# EAGLE design Jaguar (EAGLE 9.6.2)
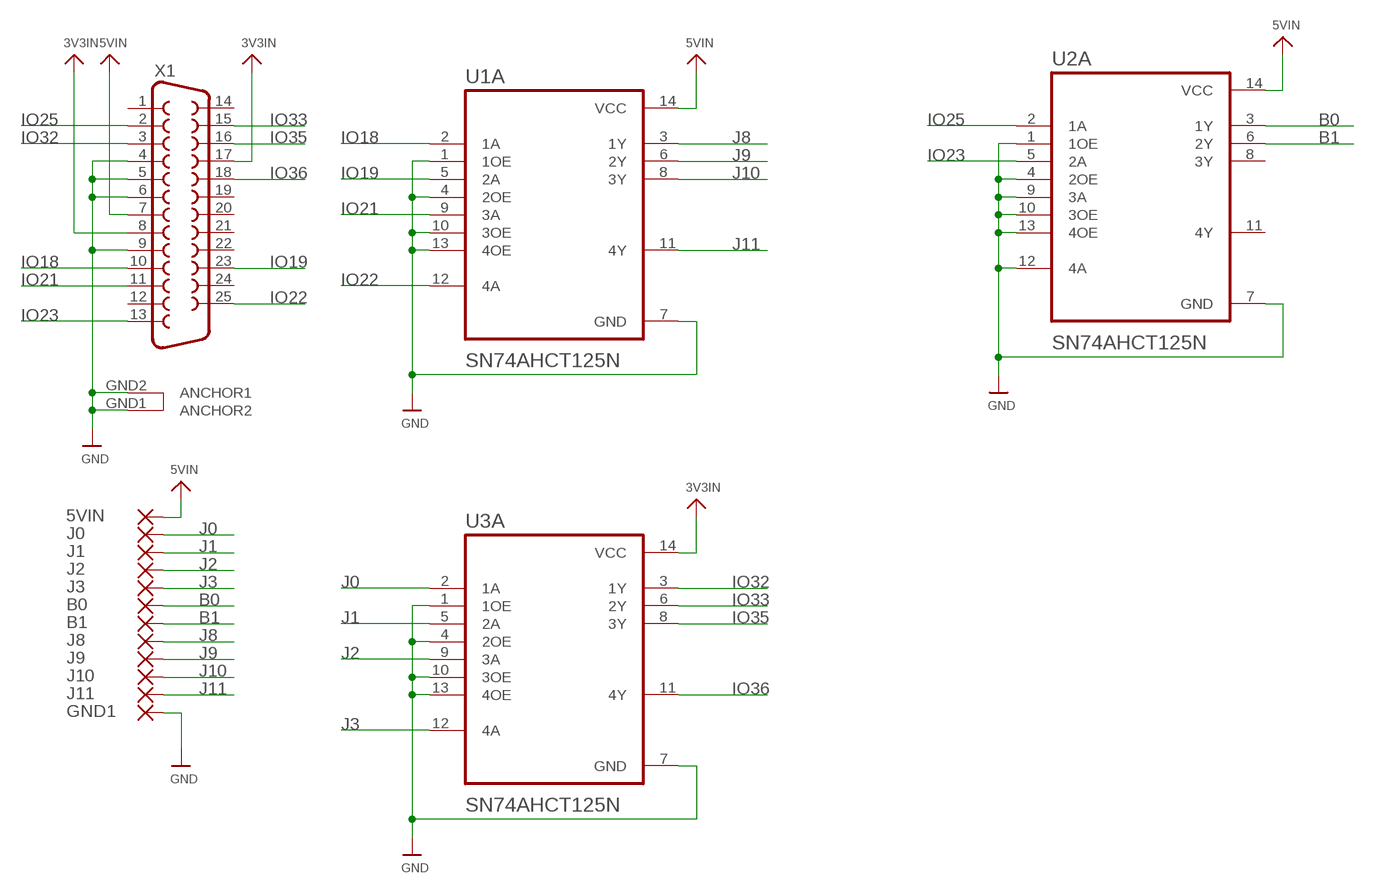
[diagram p0: schematic, sheet 1]

## Parts
5VIN  SMD5  [SMD2,54-5,08]
B0  SMD5  [SMD2,54-5,08]
B1  SMD5  [SMD2,54-5,08]
GND1  SMD5  [SMD2,54-5,08]
J0  SMD5  [SMD2,54-5,08]
J1  SMD5  [SMD2,54-5,08]
J2  SMD5  [SMD2,54-5,08]
J3  SMD5  [SMD2,54-5,08]
J8  SMD5  [SMD2,54-5,08]
J9  SMD5  [SMD2,54-5,08]
J10  SMD5  [SMD2,54-5,08]
J11  SMD5  [SMD2,54-5,08]
U1A  SN74AHCT125N  [DIP794W45P254L1969H508Q14]
U2A  SN74AHCT125N  [DIP794W45P254L1969H508Q14]
U3A  SN74AHCT125N  [DIP794W45P254L1969H508Q14]
X1  DB25_FEMALEHP  [F25HP]

## Nets
3V3IN: U3A.14(VCC) X1.8 X1.17
5VIN: 5VIN.1(P) U1A.14(VCC) U2A.14(VCC) X1.7
B0: B0.1(P) U2A.3(1Y)
B1: B1.1(P) U2A.6(2Y)
GND: GND1.1(P) U1A.1(1OE) U1A.4(2OE) U1A.7(GND) U1A.10(3OE) U1A.13(4OE) U2A.1(1OE) U2A.4(2OE) U2A.7(GND) U2A.9(3A) U2A.10(3OE) U2A.12(4A) U2A.13(4OE) U3A.1(1OE) U3A.4(2OE) U3A.7(GND) U3A.10(3OE) U3A.13(4OE) X1.4 X1.5 X1.6 X1.9 X1.GND1(ANCHOR2) X1.GND2(ANCHOR1)
IO18: U1A.2(1A) X1.10
IO19: U1A.5(2A) X1.23
IO21: U1A.9(3A) X1.11
IO22: U1A.12(4A) X1.25
IO23: U2A.5(2A) X1.13
IO25: U2A.2(1A) X1.2
IO32: U3A.3(1Y) X1.3
IO33: U3A.6(2Y) X1.15
IO35: U3A.8(3Y) X1.16
IO36: U3A.11(4Y) X1.18
J0: J0.1(P) U3A.2(1A)
J1: J1.1(P) U3A.5(2A)
J2: J2.1(P) U3A.9(3A)
J3: J3.1(P) U3A.12(4A)
J8: J8.1(P) U1A.3(1Y)
J9: J9.1(P) U1A.6(2Y)
J10: J10.1(P) U1A.8(3Y)
J11: J11.1(P) U1A.11(4Y)
Unconnected: U2A.8(3Y) U2A.11(4Y) X1.1 X1.12 X1.14 X1.19 X1.20 X1.21 X1.22 X1.24

## Library data of the parts
5VIN B0 B1 GND1 J0 J1-J3 J8-J11 = wirepad:SMD5: SMD PAD
U1A U2A U3A = SN74AHCT125N:SN74AHCT125N: None Check prices <https://pricing.snapeda.com/parts/SN74AHCT125N/Texas%20Instruments/view-part?ref=eda>; AVAILABILITY: In Stock; DESCRIPTION: Quadruple Bus Buffer Gates With 3-State Outputs 14-PDIP -40 to 125; MF: Texas Instruments; MP: SN74AHCT125N; PACKAGE: PDIP-14 Texas Instruments; PRICE: None; PURCHASE-URL: https://pricing.snapeda.com/search/part/SN74AHCT125N/?ref=eda
X1 = SparkFun-Retired:DB25_FEMALE: 25 Pin male connector. PCB edge mount for regular PCB thicknesses. This connector will connect directly to the back of a PC parallel port or through a normal DB25 extension cable (M/F). SKU: PRT-08287

## Board
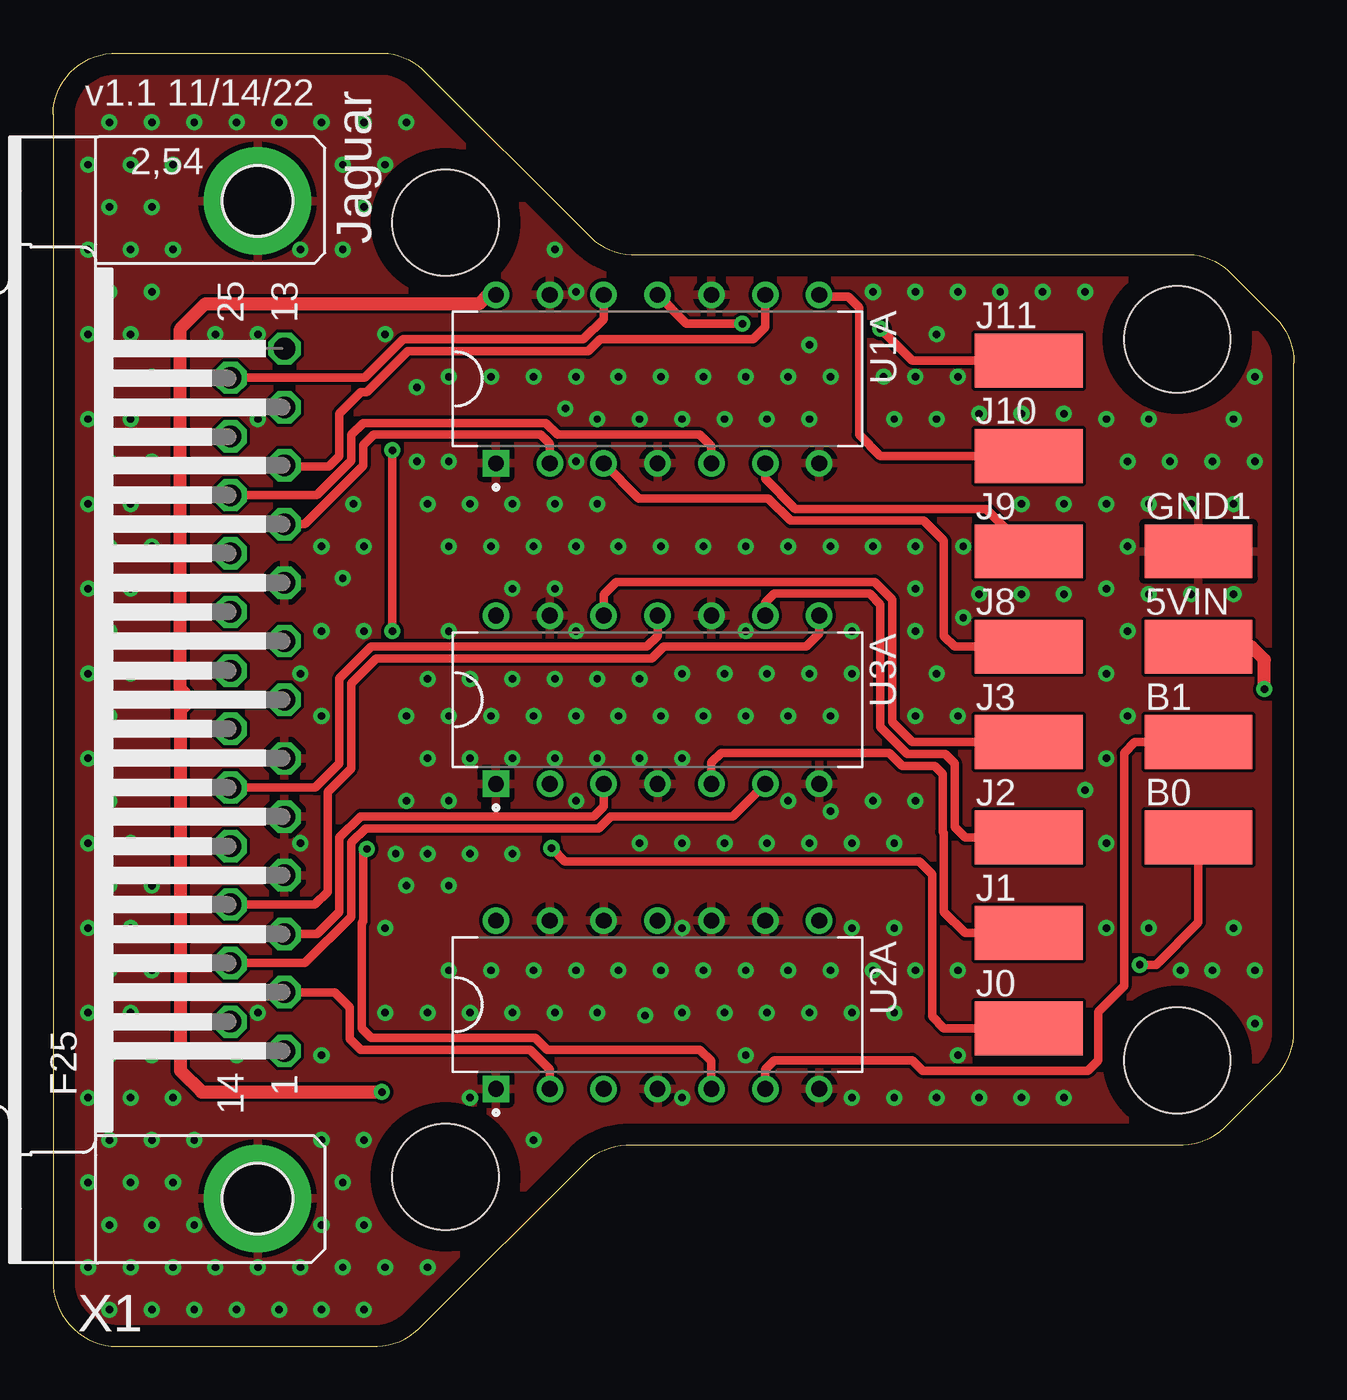
[diagram p1: board, top side]
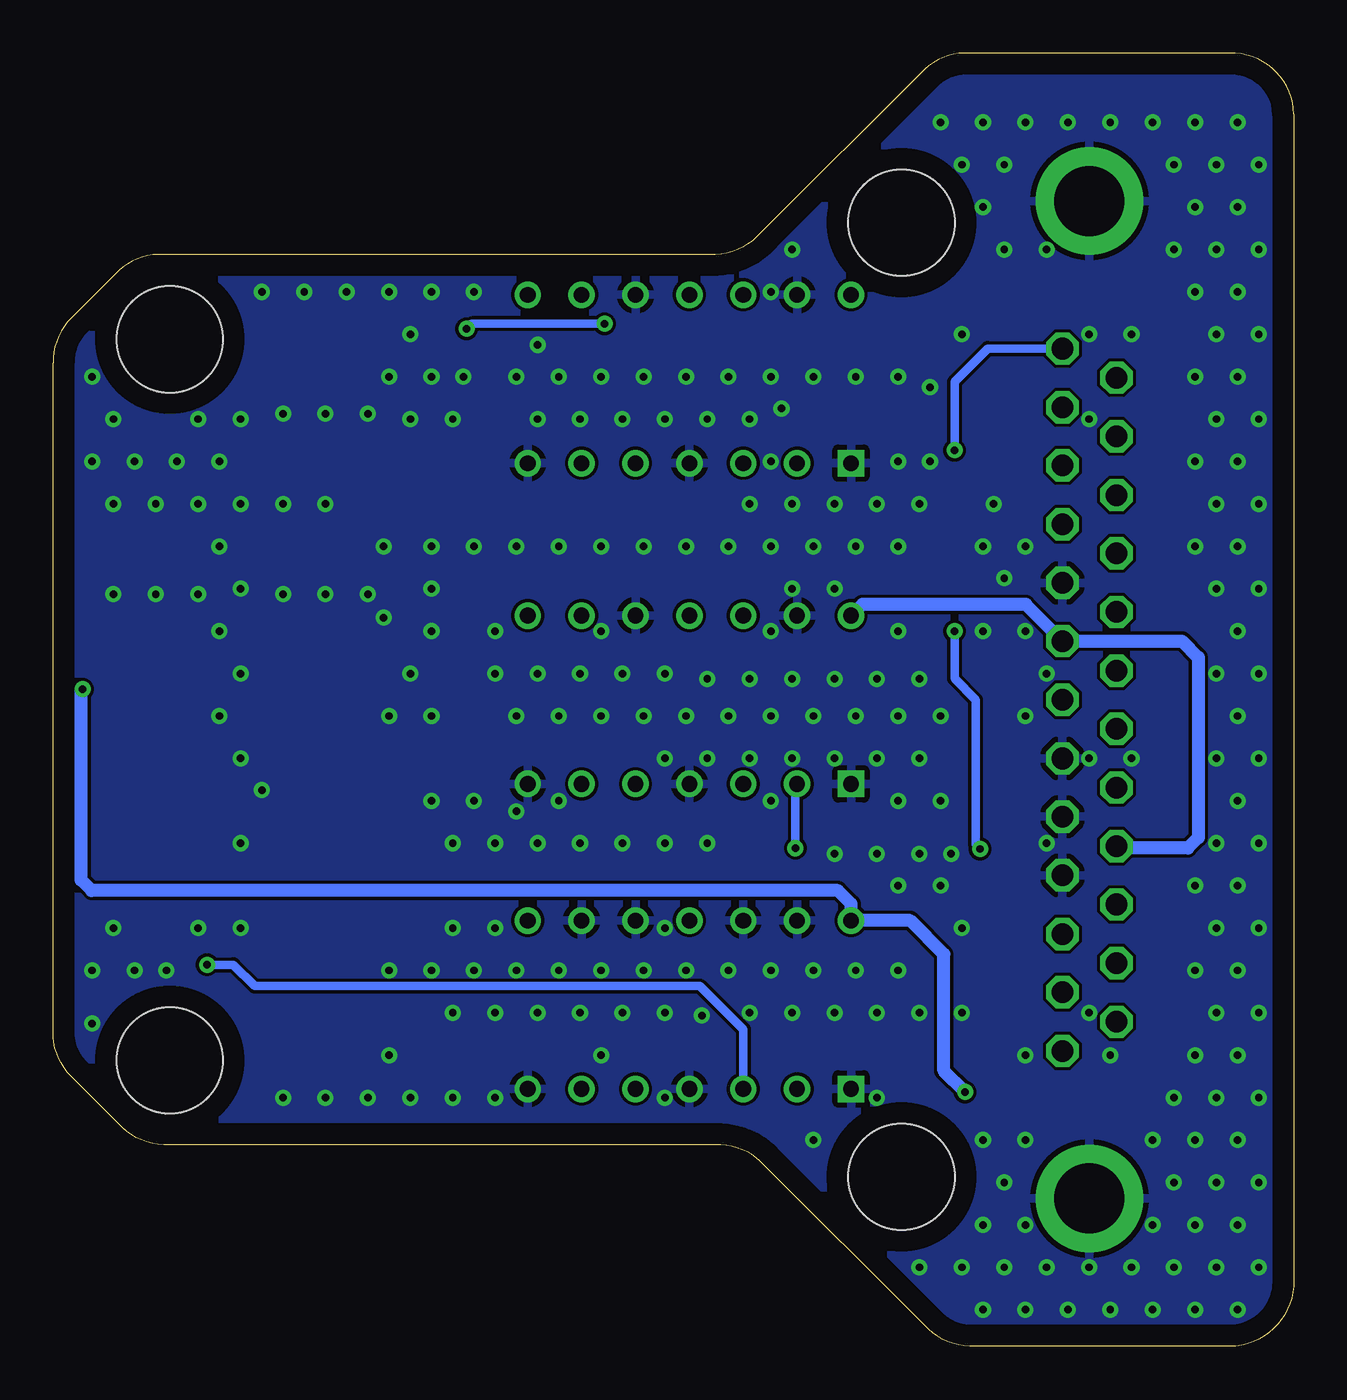
[diagram p2: board, bottom side, seen from below]

Size 58.5 x 61 mm. Coordinates in mm from the lower left corner, seen from the top.
Outline: 0,58.12 0,3.12 arc90 3.03,0 15.29,0 arc45 17.41,1 25.15,8.74 arc-45 27.27,9.5 53.29,9.5 arc45 55.41,10.5 57.65,12.74 arc45 58.5,14.86 58.5,46.38 arc45 57.65,48.5 55.41,50.74 arc45 53.29,51.5 27.27,51.5 arc-45 25.15,52.5 17.41,60.24 arc45 15.29,61 3.03,61 arc90 0,58.12
Copper layers (1*16): Top 0.035mm / dielectric 1.5mm / Bottom 0.035mm
Design rules "default": minimum track width 6mil, minimum drill 0.35mm, track to track 6mil, track to pad 6mil, pad to pad 6mil, via to via 6mil, smd to smd 6mil, copper to edge 40mil, drill to drill 6mil, minimum pad ring 10mil, minimum via ring 8mil, stop-mask expansion 4mil, vias tented up to drill 0.5mm, thermal gap 10mil
Holes 5 mm at 53,13.5 53,47.5 18.5,53 18.5,8

### Footprints (pad centres in the part's own frame; a part is rotated, then mirrored left to right if it is on the bottom)
SMD2,54-5,08 = smd 2.54 x 5.08: 1 0,0
DIP794W45P254L1969H508Q14 = drill 0.74 pad 1.14 square: 1 -3.97,7.62 | drill 0.74 pad 1.14: 2 -3.97,5.08; 3 -3.97,2.54; 4 -3.97,0; 5 -3.97,-2.54; 6 -3.97,-5.08; 7 -3.97,-7.62; 8 3.97,-7.62; 9 3.97,-5.08; 10 3.97,-2.54; 11 3.97,0; 12 3.97,2.54; 13 3.97,5.08; 14 3.97,7.62
F25HP = drill 1.016 octagon: 1 -16.561,-1.27; 2 -13.792,-1.27; 3 -11.049,-1.27; 4 -8.28,-1.27; 5 -5.512,-1.27; 6 -2.769,-1.27; 7 0,-1.27; 8 2.769,-1.27; 9 5.512,-1.27; 10 8.28,-1.27; 11 11.049,-1.27; 12 13.792,-1.27; 13 16.561,-1.27; 14 -15.189,1.27; 15 -12.421,1.27; 16 -9.652,1.27; 17 -6.909,1.27; 18 -4.14,1.27; 19 -1.372,1.27; 20 1.372,1.27; 21 4.14,1.27; 22 6.909,1.27; 23 9.652,1.27; 24 12.421,1.27; 25 15.189,1.27 | drill 3.302 pad 5.08: GND1 -23.52,0; GND2 23.52,0

### Placement (x,y rotation side)
5VIN  54,33 270 top
B0  54,24 270 top
B1  54,28.5 270 top
GND1  54,37.5 270 top
J0  46,15 270 top
J1  46,19.5 270 top
J2  46,24 270 top
J3  46,28.5 270 top
J8  46,33 270 top
J9  46,37.5 270 top
J10  46,42 270 top
J11  46,46.5 270 top
U1A  28.5,45.63 90 top
U2A  28.5,16.12 90 top
U3A  28.5,30.5 90 top
X1  9.64,30.5 90 top

### Tracks (layer width: path | path; a pad name or v marks a point on that pad's centre or on a via)
3V3IN
  Bottom 0.61: U3A.14 20.35,35 12.64,35 X1.8 5.27,33.27 4.5,32.5 4.5,24 5,23.5 8.28,23.5 X1.17
5VIN  (via drill 0.35)
  Top 0.61: 6.5,30.5 6,31 6,48 7.18,49.18 20.08,49.18 20.5,49.6 U1A.14 | X1.7 6.5,30.5 | 6.5,30.5 6,30 6,13 7,12 v15.5,12 | v57.11,31 57.11,32.39 56.5,33 5VIN.1
  Bottom 0.61: v15.5,12 16.5,13 16.5,18.5 18.09,20.09 U2A.14 20.88,20.88 21.5,21.5 56.68,21.5 57.18,22 57.18,30.93 v57.11,31
B0  (via drill 0.35)
  Top 0.406: B0.1 54,20 52,18 v51.23,18
  Bottom 0.406: U2A.3 25.96,14.96 28,17 49,17 50,18 v51.23,18
B1
  Top 0.406: U2A.6 33.58,13.08 34,13.5 40.5,13.5 41,13 48.78,13 49.28,13.5 49.28,15.78 50.5,17 50.5,28 51,28.5 B1.1
GND  (via drill 0.35)
  other vias: 2.66,1.74 1.66,3.74 2.66,5.74 1.66,7.74 2.66,9.74 1.66,11.74 2.66,13.74 1.66,15.74 2.66,17.74 1.66,19.74 2.66,21.74 1.66,23.74 2.66,25.74 1.66,27.74 2.66,29.74 1.66,31.74 2.66,33.74 1.66,35.74 2.66,37.74 1.66,39.74 2.66,41.74 1.66,43.74 2.66,45.74 1.66,47.74 2.66,49.74 1.66,51.74 2.66,53.74 1.66,55.74 2.66,57.74 4.66,1.74 3.66,3.74 4.66,5.74 3.66,7.74 4.66,9.74 3.66,11.74 4.66,13.74 3.66,15.74 4.66,17.74 3.66,19.74 4.66,21.74 3.66,23.74 3.66,27.74 3.66,31.74 3.66,35.74 4.66,37.74 3.66,39.74 4.66,41.74 3.66,43.74 4.66,45.74 3.66,47.74 4.66,49.74 3.66,51.74 4.66,53.74 3.66,55.74 4.66,57.74 6.66,1.74 5.66,3.74 6.66,5.74 5.66,7.74 6.66,9.74 5.66,11.74 5.66,51.74 5.66,55.74 6.66,57.74 8.66,1.74 7.66,3.74 8.66,13.74 7.66,27.74 7.66,47.74 8.66,57.74 10.66,1.74 9.66,3.74 9.66,15.74 9.66,27.74 9.66,43.74 9.66,47.74 10.66,57.74 12.66,1.74 11.66,3.74 12.66,5.74 12.66,9.74 12.66,13.74 11.66,23.74 12.66,29.74 11.66,31.74 12.66,33.74 12.66,37.74 11.66,51.74 12.66,57.74 14.66,1.74 13.66,3.74 14.66,5.74 13.66,7.74 14.66,9.74 14.66,33.74 13.66,36.24 14.66,37.74 14.16,39.74 13.66,51.74 14.66,53.74 13.66,55.74 14.66,57.74 15.66,3.74 15.66,15.74 15.66,19.74 16.66,21.74 16.16,23.24 16.66,25.74 16.66,29.74 17.16,41.74 17.16,45.24 15.66,47.74 15.66,55.74 16.66,57.74 17.66,3.74 17.66,15.74 18.66,17.74 18.66,21.74 17.66,23.24 18.66,25.74 17.66,27.74 18.66,29.74 17.66,31.48 18.66,33.74 18.66,37.74 17.66,39.74 18.66,41.74 18.66,45.74 19.66,11.74 19.66,15.74 20.66,17.74 19.66,23.24 19.66,27.74 20.66,29.74 19.66,31.48 20.66,37.74 19.66,39.74 20.66,45.74 22.66,9.74 21.66,15.74 22.66,17.74 21.66,23.24 21.66,27.74 22.66,29.74 21.66,31.48 21.66,35.74 22.66,37.74 21.66,39.74 22.66,45.74 23.66,15.74 24.66,17.74 24.66,25.74 23.66,27.74 24.66,29.74 23.66,31.48 24.66,33.74 23.66,35.74 24.66,37.74 23.66,39.74 24.66,41.74 24.16,44.24 24.66,45.74 24.66,49.74 23.66,51.74 25.66,15.74 26.66,17.74 25.66,27.74 26.66,29.74 25.66,31.48 26.66,37.74 25.66,39.74 25.66,43.74 26.66,45.74 27.91,15.61 28.66,17.74 27.66,23.74 27.66,27.74 28.66,29.74 27.66,31.48 28.66,37.74 27.66,43.74 28.66,45.74 29.66,11.74 29.66,15.74 30.66,17.74 29.66,19.74 29.66,23.74 29.66,27.74 30.66,29.74 29.66,31.74 30.66,37.74 29.66,43.74 30.66,45.74 32.66,13.74 31.66,15.74 32.66,17.74 31.66,23.74 32.66,29.74 31.66,31.74 32.66,33.74 32.66,37.74 31.66,43.74 32.66,45.74 33.66,15.74 34.66,17.74 33.66,23.74 34.66,25.74 34.66,29.74 33.66,31.74 34.66,37.74 33.66,43.74 34.66,45.74 35.66,15.74 36.66,17.74 35.66,23.74 36.66,25.24 36.66,29.74 35.66,31.74 37.66,33.74 36.66,37.74 35.66,43.74 36.66,45.74 35.66,47.24 37.66,11.74 37.66,15.74 38.66,17.74 37.66,19.74 37.66,23.74 38.66,25.74 37.66,31.74 38.66,37.74 39.16,45.74 38.66,49.74 39.66,11.74 39.66,15.74 40.66,17.74 39.66,19.74 39.66,23.74 40.66,25.74 40.66,29.74 40.66,33.74 40.66,35.74 40.66,37.74 39.66,43.74 40.66,45.74 40.66,49.74 41.66,11.74 42.66,13.74 42.66,17.74 42.66,29.74 41.66,31.74 42.91,34.37 42.91,37.74 41.66,43.74 42.66,45.74 41.66,47.74 42.66,49.74 43.66,11.74 43.66,35.48 43.66,43.99 44.66,49.74 45.66,11.74 45.66,35.48 45.66,39.74 45.66,43.99 46.66,49.74 47.66,11.74 48.66,26.24 47.66,35.48 47.66,39.74 47.66,43.99 48.66,49.74 49.66,19.74 49.66,23.74 49.66,27.74 50.66,29.74 49.66,31.74 50.66,33.74 49.66,35.74 50.66,37.74 49.66,39.74 50.66,41.74 49.66,43.74 53.16,17.74 51.66,19.74 51.66,35.48 51.66,39.74 52.66,41.74 51.66,43.74 54.66,17.74 53.66,35.48 53.66,39.74 54.66,41.74 56.66,15.24 56.66,17.74 55.66,19.74 55.66,35.48 55.66,39.74 56.66,41.74 55.66,43.74 56.66,45.74
  pour Bottom: 0,0 0,61.12 28.53,61.12 28.53,51.62 59.03,51.62 59.03,9.5 28.03,9.5 28.03,0
  pour Top: 0,0 0,61.12 28.53,61.12 28.53,51.62 59.03,51.62 59.03,9.5 28.03,9.5 28.03,0
IO18
  Top 0.406: U1A.2 23.42,42.58 23,43 15.12,43 14.62,42.5 14.62,41.54 11.86,38.78 X1.10
IO19
  Top 0.406: U1A.5 31.04,42.46 30.5,43 23.79,43 23.23,43.56 14.62,43.56 14.06,43 14.06,41.77 12.44,40.15 X1.23
IO21
  Top 0.406: U1A.9 33.58,48.08 33,47.5 25.79,47.5 25.23,46.94 16.73,46.94 14.79,45 14.5,45 13.5,44 13.5,42 13,41.5 10.96,41.5 X1.11
IO22
  Top 0.406: U1A.12 25.96,48.46 25,47.5 16.5,47.5 14.69,45.69 X1.25
IO23  (via drill 0.35)
  Top 0.406: U2A.5 31.04,13.46 30.5,14 23.29,14 22.73,14.56 15,14.56 14.56,15 14.56,19.98 14.62,20.04 14.62,23.29 v14.79,23.46 | v16,33.73 v16,42.27
  Bottom 0.406: v14.79,23.46 15,23.67 15,30.5 16,31.5 v16,33.73 | X1.13 14.44,47.06 16,45.5 v16,42.27
IO25
  Top 0.406: U2A.2 23.42,13.08 22.5,14 14.5,14 14,14.5 14,16 13.29,16.71 X1.2
IO32
  Top 0.406: U3A.3 25.96,25.46 25.5,25 14.5,25 13.5,24 13.5,20.5 12.45,19.45 X1.3
IO33
  Top 0.406: U3A.6 32.05,25 26.29,25 25.73,24.44 14.73,24.44 14.06,23.77 14.06,20.27 11.87,18.08 X1.15
IO35
  Top 0.406: U3A.8 36.12,33.62 35.5,33 28.79,33 28.23,32.44 15.23,32.44 14.06,31.27 14.06,27.27 12.94,26.15 12.94,21.44 12.35,20.85 X1.16
IO36
  Top 0.406: U3A.11 28.5,33.5 28,33 15,33 13.5,31.5 13.5,27.5 12.36,26.36 X1.18
J0  (via drill 0.35)
  Top 0.406: J0.1 42,15 41.44,15.56 41.44,22.27 40.83,22.88 24.12,22.88 v23.5,23.5
  Bottom 0.406: U3A.2 23.5,26.45 v23.5,23.5
J1
  Top 0.406: U3A.5 31.04,27.54 31.5,28 39.42,28 40.04,27.38 41.56,27.38 41.94,27 41.94,24.27 42,24.21 42,20.5 43,19.5 J1.1
J2
  Top 0.406: U3A.9 33.58,35.08 34,35.5 38.5,35.5 39,35 39,29.21 40.27,27.94 42.06,27.94 42.5,27.5 42.5,24.5 43,24 J2.1
J3
  Top 0.406: U3A.12 25.96,35.46 26.56,36.06 38.73,36.06 39.56,35.23 39.56,29.44 40.5,28.5 J3.1
J8
  Top 0.406: U1A.3 27.62,40 33.71,40 34.77,38.94 41.06,38.94 42,38 42,33.5 42.5,33 J8.1
J9
  Top 0.406: U1A.6 33.58,40.92 35,39.5 44,39.5 J9.1
J10
  Top 0.406: U1A.8 36.22,49.5 37.5,49.5 38,49 38,43 39,42 J10.1
J11  (via drill 0.35)
  Top 0.406: U1A.11 29.86,48.23 v32.5,48.23 | v39,48 40.5,46.5 J11.1
  Bottom 0.406: v32.5,48.23 38.77,48.23 v39,48

### Text on the board
tPlace: v1.1 11/14/22 | Jaguar